# Altium schematic sheet D_INPUT.SchDoc
size A3; SheetNumber: 2; SheetTotal: 10
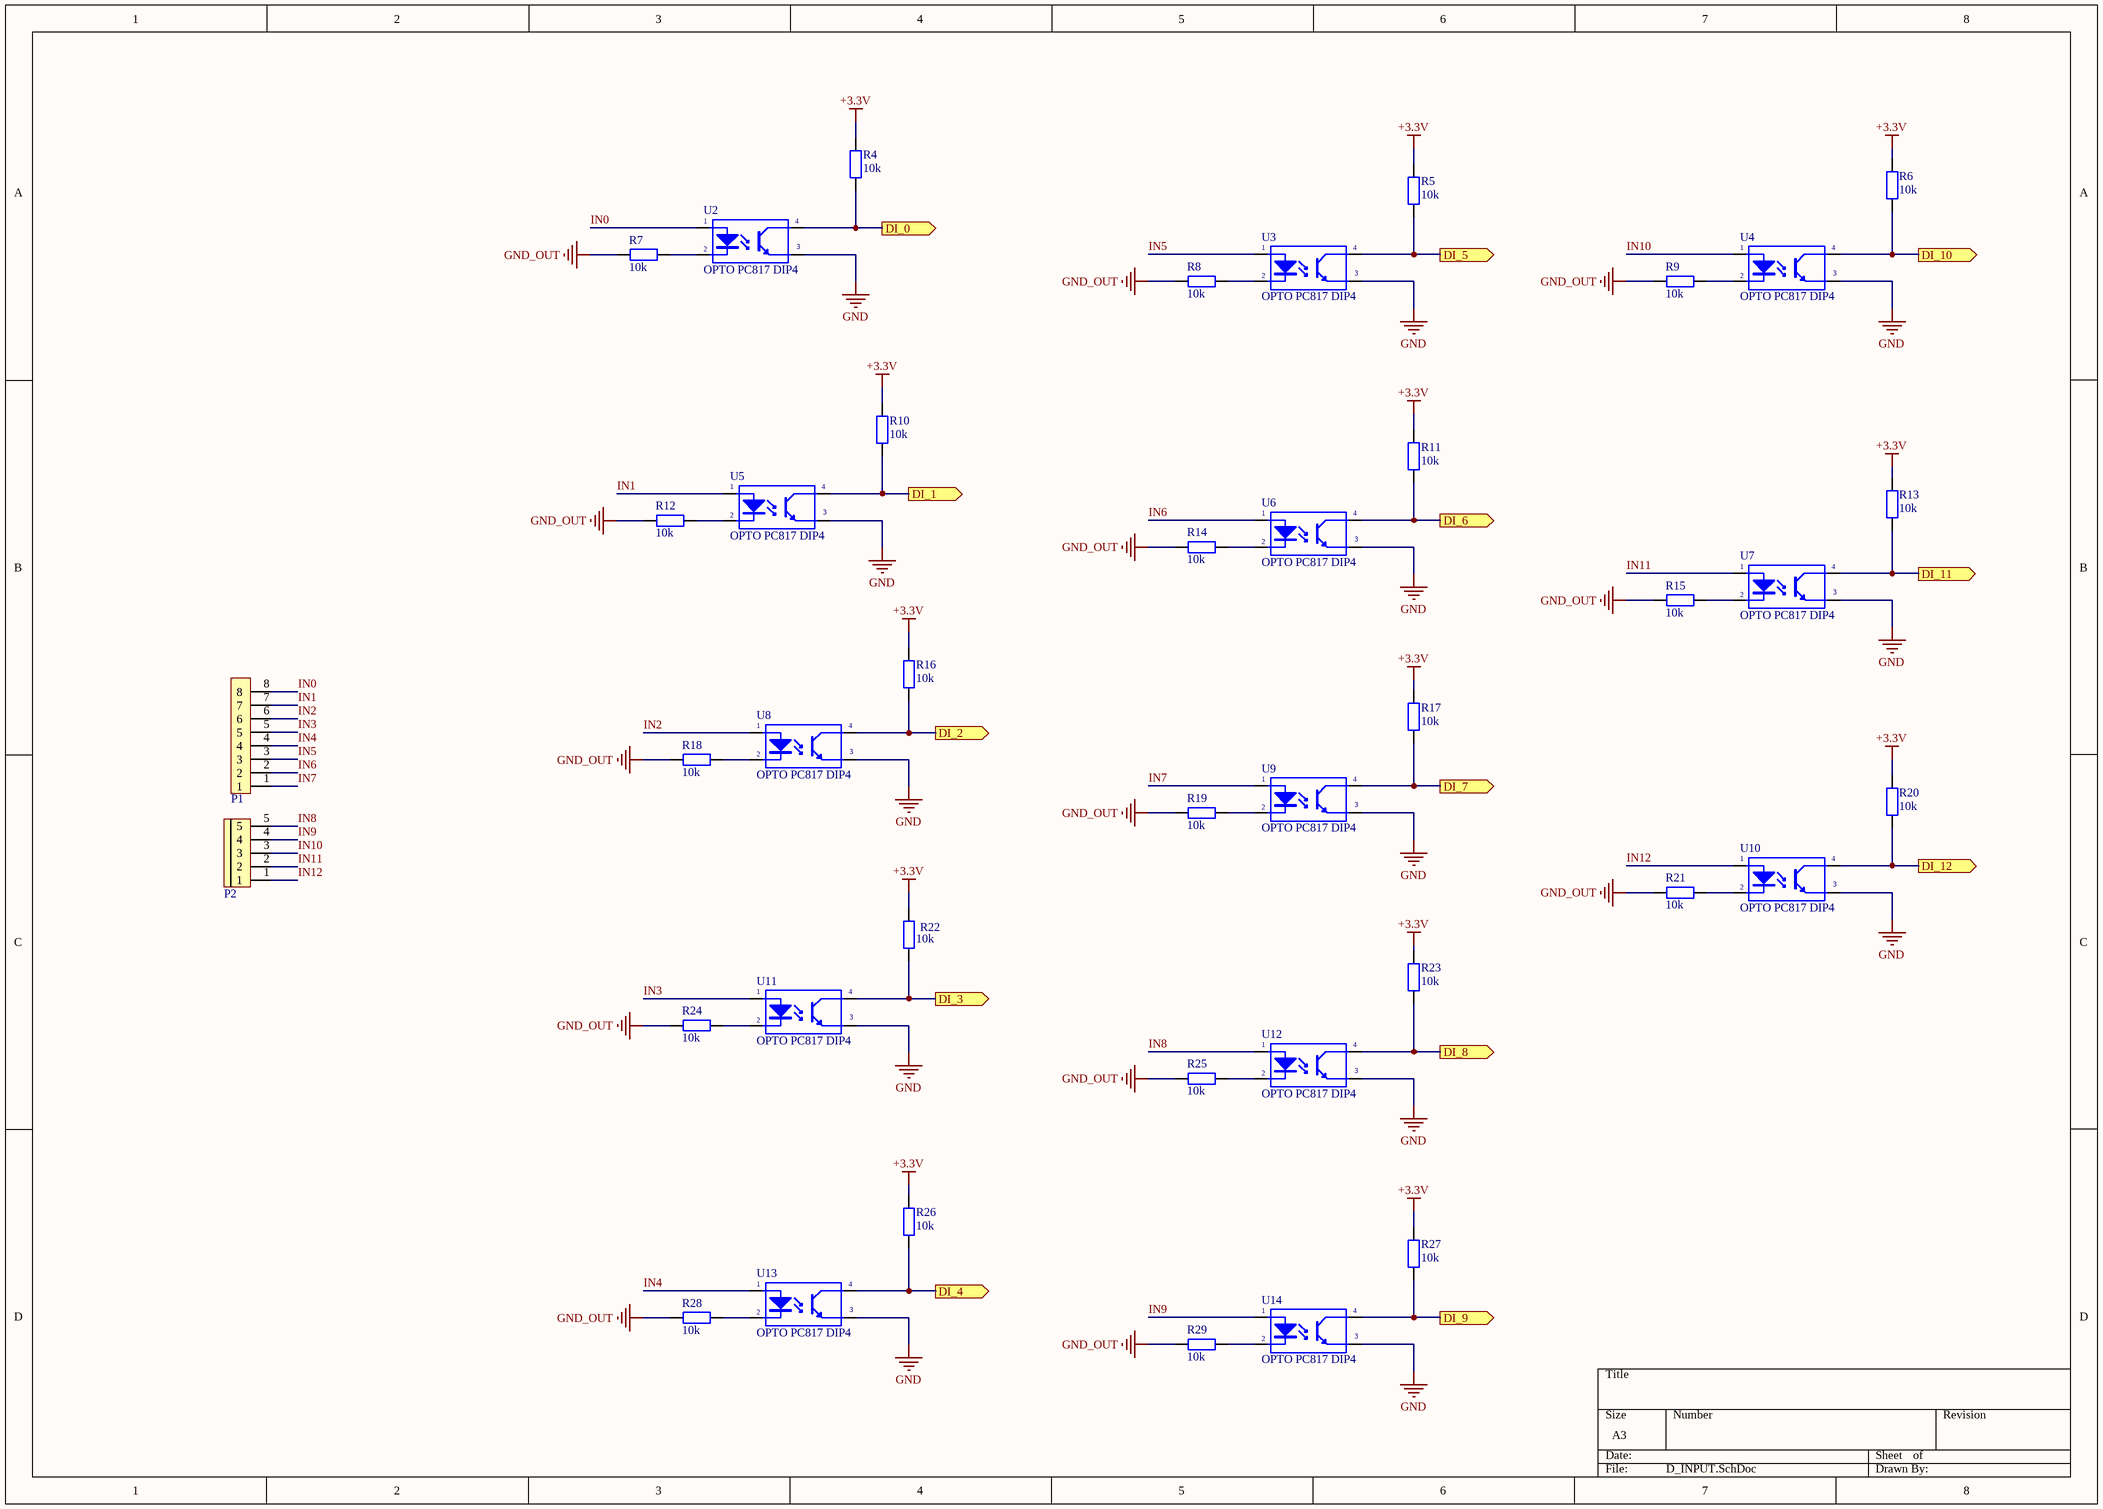
[diagram p0: D_INPUT.SchDoc]

## Parts
P1  CON 8 EDG5.08  [CON 8 8EDG5.08]  (value not drawn)
P2  CON 5 EDG5.08  [CON 5 5EDG5.08]  (value not drawn)
R4  10k  [tro smd 0805]
R5  10k  [tro smd 0805]
R6  10k  [tro smd 0805]
R7  10k  [tro smd 0805]
R8  10k  [tro smd 0805]
R9  10k  [tro smd 0805]
R10  10k  [tro smd 0805]
R11  10k  [tro smd 0805]
R12  10k  [tro smd 0805]
R13  10k  [tro smd 0805]
R14  10k  [tro smd 0805]
R15  10k  [tro smd 0805]
R16  10k  [tro smd 0805]
R17  10k  [tro smd 0805]
R18  10k  [tro smd 0805]
R19  10k  [tro smd 0805]
R20  10k  [tro smd 0805]
R21  10k  [tro smd 0805]
R22  10k  [tro smd 0805]
R23  10k  [tro smd 0805]
R24  10k  [tro smd 0805]
R25  10k  [tro smd 0805]
R26  10k  [tro smd 0805]
R27  10k  [tro smd 0805]
R28  10k  [tro smd 0805]
R29  10k  [tro smd 0805]
U2  OPTO PC817 DIP4  [DIP4]
U3  OPTO PC817 DIP4  [DIP4]
U4  OPTO PC817 DIP4  [DIP4]
U5  OPTO PC817 DIP4  [DIP4]
U6  OPTO PC817 DIP4  [DIP4]
U7  OPTO PC817 DIP4  [DIP4]
U8  OPTO PC817 DIP4  [DIP4]
U9  OPTO PC817 DIP4  [DIP4]
U10  OPTO PC817 DIP4  [DIP4]
U11  OPTO PC817 DIP4  [DIP4]
U12  OPTO PC817 DIP4  [DIP4]
U13  OPTO PC817 DIP4  [DIP4]
U14  OPTO PC817 DIP4  [DIP4]

## Ports
DI_0 (out), DI_1 (out), DI_2 (out), DI_3 (out), DI_4 (out), DI_5 (out), DI_6 (out), DI_7 (out), DI_8 (out), DI_9 (out), DI_10 (out), DI_11 (out), DI_12 (out)

## Nets
+3.3V: R4.2 R5.2 R6.2 R10.2 R11.2 R13.2 R16.2 R17.2 R20.2 R22.2 R23.2 R26.2 R27.2
GND: U2.3(E) U3.3(E) U4.3(E) U5.3(E) U6.3(E) U7.3(E) U8.3(E) U9.3(E) U10.3(E) U11.3(E) U12.3(E) U13.3(E) U14.3(E)
GND_OUT: R7.1 R8.1 R9.1 R12.1 R14.1 R15.1 R18.1 R19.1 R21.1 R24.1 R25.1 R28.1 R29.1
DI_0: R4.1 U2.4(C) ; port DI_0
DI_1: R10.1 U5.4(C) ; port DI_1
DI_2: R16.1 U8.4(C) ; port DI_2
DI_3: R22.1 U11.4(C) ; port DI_3
DI_4: R26.1 U13.4(C) ; port DI_4
DI_5: R5.1 U3.4(C) ; port DI_5
DI_6: R11.1 U6.4(C) ; port DI_6
DI_7: R17.1 U9.4(C) ; port DI_7
DI_8: R23.1 U12.4(C) ; port DI_8
DI_9: R27.1 U14.4(C) ; port DI_9
DI_10: R6.1 U4.4(C) ; port DI_10
DI_11: R13.1 U7.4(C) ; port DI_11
DI_12: R20.1 U10.4(C) ; port DI_12
IN0: P1.8 U2.1(A)
IN1: P1.7 U5.1(A)
IN2: P1.6 U8.1(A)
IN3: P1.5 U11.1(A)
IN4: P1.4 U13.1(A)
IN5: P1.3 U3.1(A)
IN6: P1.2 U6.1(A)
IN7: P1.1 U9.1(A)
IN8: P2.5 U12.1(A)
IN9: P2.4 U14.1(A)
IN10: P2.3 U4.1(A)
IN11: P2.2 U7.1(A)
IN12: P2.1 U10.1(A)
NetR7_2: R7.2 U2.2(K)
NetR8_2: R8.2 U3.2(K)
NetR9_2: R9.2 U4.2(K)
NetR12_2: R12.2 U5.2(K)
NetR14_2: R14.2 U6.2(K)
NetR15_2: R15.2 U7.2(K)
NetR18_2: R18.2 U8.2(K)
NetR19_2: R19.2 U9.2(K)
NetR21_2: R21.2 U10.2(K)
NetR24_2: R24.2 U11.2(K)
NetR25_2: R25.2 U12.2(K)
NetR28_2: R28.2 U13.2(K)
NetR29_2: R29.2 U14.2(K)

## Library data of the parts
P1 = CON 8 EDG5.08: Cắm; Ten_Linh_Kien: CON 8 2EDG5.08-8P 5.08MM ( Xanh Cong); Ma_Hang: MH000978; Don_Vi: Con; Ghi_Chu: *; Kieu_Chan: *; Chung_Loai: Cắm
P2 = CON 5 EDG5.08: Cắm; Ten_Linh_Kien: CON 5 2EDG5.08-5P 5.08MM ( Xanh Cong); Ma_Hang: MH003589; Kieu_Chan: *; Don_Vi: Con; Ghi_Chu: *; Chung_Loai: Cắm
R4-R29 = Tro 0805 1% 10k: Dán; Don_Vi: Con; So_Chan: 2; Ten_Linh_Kien: Trở 0805 1% 10k; Ma_Hang: MH005473; Chung_Loai: Dán; Kieu_Chan: *
U2-U14 = OPTO PC817 DIP4: Single Opto; Value: PC817